# EAGLE design untitled (EAGLE 5.10)
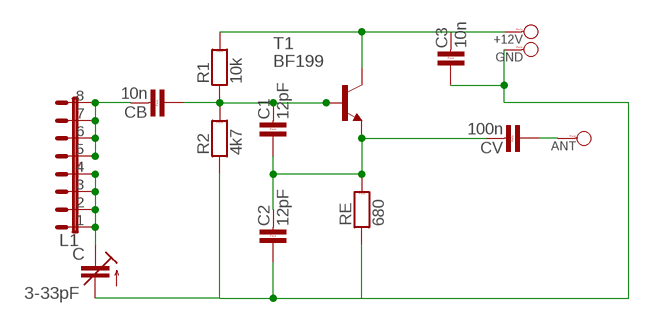
[diagram p0: schematic, sheet 1]

## Parts
+12V  PAD_1  [PAD_1]
ANT  PAD_1  [PAD_1]
C  3-33pF  C-TRIMM808-1  [CTRIM808-1]
C1  12pF  C-5  [C-5]
C2  12pF  C-5  [C-5]
C3  10n  C-5  [C-5]
CB  10n  C-5  [C-5]
CV  100n  C-5  [C-5]
GND  PAD_1  [PAD_1]
L1  S1G8_JUMP  [S1G8_JUM]
R1  10k  R-7,5  [R-7,5]
R2  4k7  R-7,5  [R-7,5]
RE  680  R-7,5  [R-7,5]
T1  BF199  [TO92]

## Nets
GND: C2.1 C3.1 C.2(A) GND.1 R2.1 RE.1
N$2: CB.2 L1.5 L1.6 L1.7 L1.8
N$3: C1.2 CB.1 R1.1 R2.2 T1.1(B)
N$4: +12V.1 C3.2 R1.2 T1.3(C)
N$6: C.1(E) L1.1 L1.2 L1.3 L1.4
N$8: C1.1 C2.2 CV.2 RE.2 T1.2(E)
N$9: ANT.1 CV.1

## Library data of the parts
+12V ANT GND = #PaJa_92:PAD_1
C = rcl:C-TRIMM: Trimm capacitor
C1-C3 CB CV = #PaJa_92:C-5
L1 = #PaJa_92:S1G8_JUMP
R1 R2 RE = #PaJa_92:R-7,5
T1 = transistor:BF199: NPN TRANSISTOR

## Board
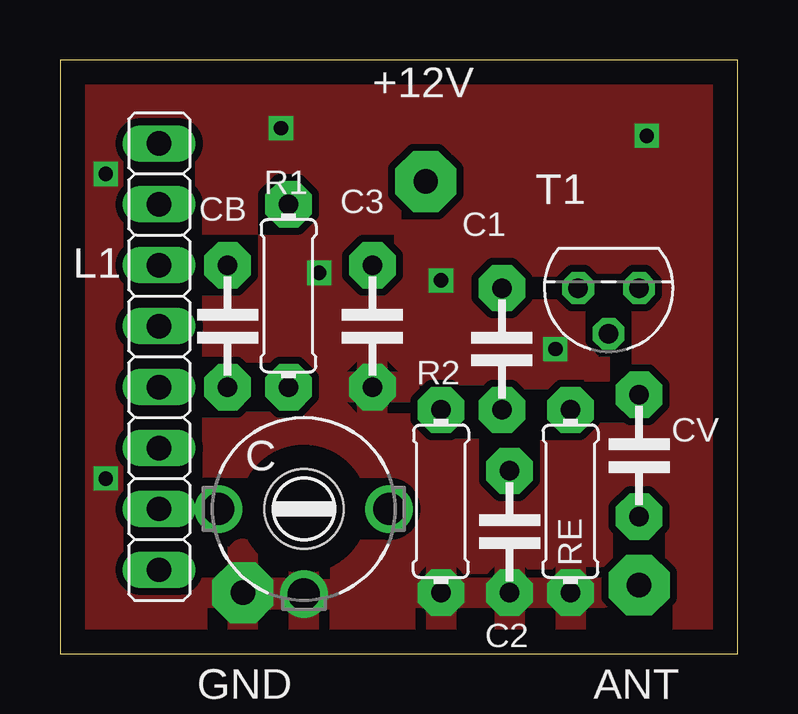
[diagram p1: board, top side]
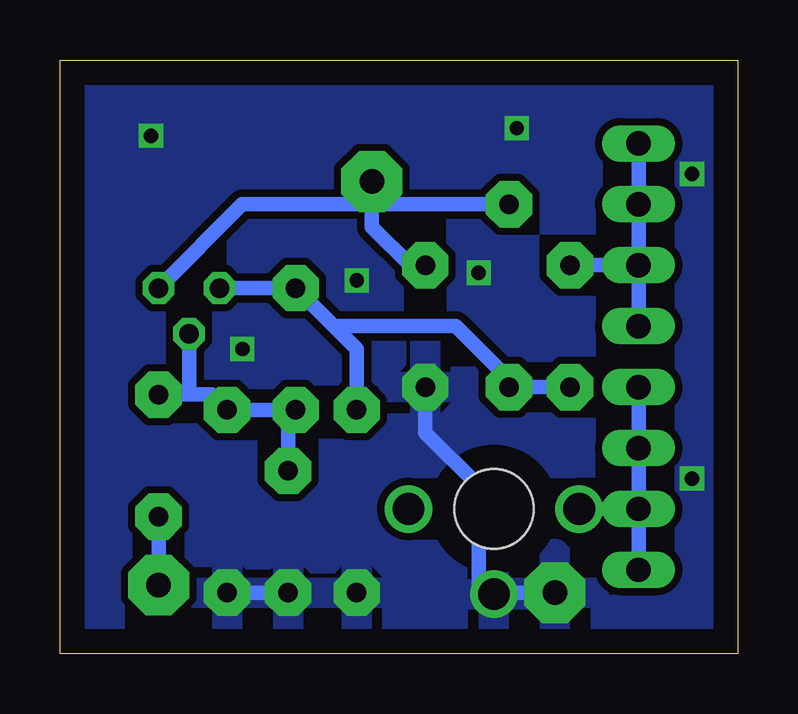
[diagram p2: board, bottom side, seen from below]

Size 28.24 x 24.75 mm. Coordinates in mm from the lower left corner, seen from the top.
Outline: 0,0 28.24,0 28.24,24.75 0,24.75 0,0
Copper layers (1*16): Top 0.035mm / dielectric 1.5mm / Bottom 0.035mm
Design rules "default": minimum track width 10mil, minimum drill 24mil, track to track 8mil, track to pad 8mil, pad to pad 8mil, via to via 8mil, smd to smd 8mil, copper to edge 40mil, drill to drill 8mil, minimum pad ring 10mil, minimum via ring 8mil, stop-mask expansion 4mil, vias tented up to drill 0mil, thermal gap 10mil

### Footprints (pad centres in the part's own frame; a part is rotated, then mirrored left to right if it is on the bottom)
PAD_1 = drill 1.016 pad 2.54 octagon: 1 0,0
CTRIM808-1 = drill 1.321 round: 1 -3.556,0; 2 0,-3.556; 3 3.556,0 | hole 3.302: 0,0
C-5 = drill 0.813 pad 1.93 octagon: 1 -2.54,0; 2 2.54,0
S1G8_JUM = drill 1.016 pad 1.27 long: 1 -8.89,0; 2 -6.35,0; 3 -3.81,0; 4 -1.27,0; 5 1.27,0; 6 3.81,0; 7 6.35,0; 8 8.89,0
R-7,5 = drill 0.813 pad 1.93 octagon: 1 -3.81,0; 2 3.81,0
TO92 = drill 0.813 octagon: 1 1.27,0; 2 0,1.905; 3 -1.27,0

### Placement (x,y rotation side)
+12V  15.24,19.69 0 top
ANT  24.13,2.86 0 top
C  10.16,6.03 0 top
C1  18.41,12.7 90 top
C2  18.73,5.08 90 top
C3  13.02,13.65 90 top
CB  6.99,13.65 90 top
CV  24.13,8.26 90 top
GND  7.62,2.54 0 top
L1  4.13,12.38 90 top
R1  9.53,14.92 90 top
R2  15.88,6.35 90 top
RE  21.27,6.35 90 top
T1  22.86,15.24 180 top

### Tracks (layer width: path | path; a pad name or v marks a point on that pad's centre or on a via)
GND  (via drill 0.6)
  Bottom 0.61: C2.1 RE.1 | C3.1 13.02,9.21 10.79,6.98 10.79,2.48 C.2 10.1,2.54 GND.1
  other vias: 1.9,7.3 1.9,20 9.21,21.91 24.45,21.59 20.64,12.7 10.79,15.88 15.88,15.56
  pour Bottom (isolate 0.305): 0,0 28.26,0 28.26,24.77 0,24.77
  pour Top (isolate 0.305): 0,0 28.26,0 28.26,24.77 0,24.77
N$2
  Bottom 0.61: L1.8 L1.7 L1.6 | L1.6 CB.2 | L1.5 L1.6
N$3
  Bottom 0.61: CB.1 R1.1 9.52,11.43 11.75,13.65 16.83,13.65 | R2.2 15.87,12.7 16.83,13.65 | 16.83,13.65 C1.2 T1.1
N$4
  Bottom 0.61: R1.2 15.24,18.73 | 15.24,18.73 20.64,18.73 T1.3 | 15.24,18.73 +12V.1 | C3.2 13.65,16.19 15.24,17.78 15.24,18.73
N$6
  Bottom 0.61: L1.4 L1.3 L1.2 | L1.1 L1.2 | L1.2 C.1
N$8
  Bottom 0.61: 22.86,10.79 21.91,10.79 RE.2 C1.1 18.73,9.84 C2.2 | 22.86,10.79 CV.2 | 22.86,10.79 T1.2
N$9
  Bottom 0.61: ANT.1 CV.1